# Altium schematic sheet 3.4_4.2V_TO_FIXED_3.3V.SchDoc
size A; SheetNumber: 6; SheetTotal: 30
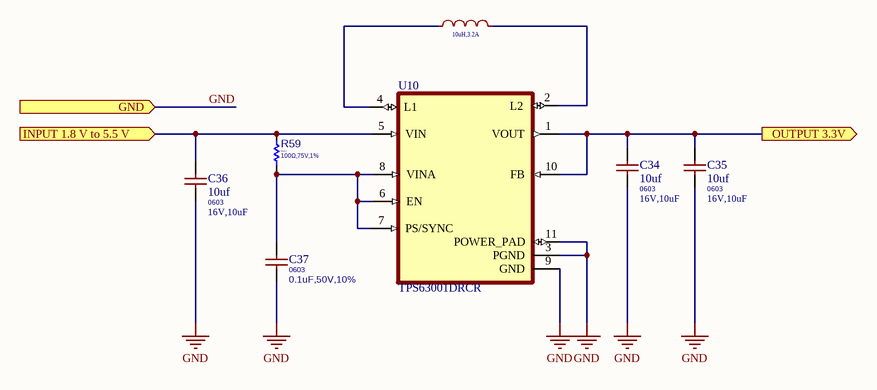
[diagram p0: 3.4_4.2V_TO_FIXED_3.3V.SchDoc]

## Parts
C34  10uf  value 16V,10uF  Package: 0603  [CAPC1608X90N]
C35  10uf  value 16V,10uF  Package: 0603  [CAPC1608X90N]
C36  10uf  value 16V,10uF  Package: 0603  [CAPC1608X90N]
C37  Package: 0603  [C0603]  (hidden comment: 0.1uF,50V,10%)
L1  value 10uH,3.2A  [inductor_SMD,5.2x5.4mm]  (hidden comment: 10uH)
R59  value 100Ω,75V,1%  Package: 0603  [R0603]  (hidden comment: 100Ω)
U10  TPS63001DRCR  [VREG_V62/16624-01YE]

## Ports
GND (in), INPUT 1.8 V to 5.5 V (in), OUTPUT 3.3V (out)

## Nets
GND: C34.1 C35.1 C36.1 C37.1 U10.3(PGND) U10.9(GND) U10.11(POWER_PAD) ; port GND
INPUT 1.8 V to 5.5 V: C36.2 R59.2 U10.5(VIN) ; port INPUT 1.8 V to 5.5 V
OUTPUT 3.3V: C34.2 C35.2 U10.1(VOUT) U10.10(FB) ; port OUTPUT 3.3V
NetC37_2: C37.2 R59.1 U10.6(EN) U10.7(PS/SYNC) U10.8(VINA)
NetL1_1: L1.1 U10.4(L1)
NetL1_2: L1.2 U10.2(L2)

## Library data of the parts
C34-C36 = 0603F106M160NT: 16V 10uF Y5V ±20% 0603 Multilayer Ceramic Capacitors MLCC - SMD/SMT ROHS; Manufacturer: KEMET; MPN: CC0603KRX7R9BB104; Datasheet: http://componentsearchengine.com/Datasheets/3/CC0603KRX7R9BB104.pdf; LCSC: C48906
C37 = GCM188R71H104KA57J: CAP CER 0.1UF 50V X7R 0603; Manufacturer: Murata Electronics; Type: SM; Min Operating Temp: -55°C; Max Operating Temp: 125°C; MPN: GCM188R71H104KA57J; Datasheet: https://datasheet.lcsc.com/lcsc/2404081050_Murata-Electronics-GCM188R71H104KA57J_C3011652.pdf; LCSC: C3011652; Value: 0.1uF,50V,10%
L1 = FXL0530-100-M: 3.2A 10uH Integrated molded inductor ±20% 3.5A SMD,5.2x5.4mm Power Inductors ROHS; Manufacturer: cjiang; LCSC: C177248; MPN: FXL0530-100-M; Package: SMD,5.2x5.4mm; Datasheet: https://atta.szlcsc.com/upload/public/pdf/source/20240426/3189EA8206330E2108542F9E34E540E7.pdf
R59 = AC0603FR-13100RL: 100mW Thick Film Resistors 75V ±100ppm/℃ ±1% 100Ω 0603 Chip Resistor - Surface Mount ROHS; Manufacturer: YAGEO(国巨); Min Operating Temp: -55; Max Operating Temp: +155; Type: *; MPN: AC0603FR-13100RL; Datasheet: https://datasheet.lcsc.com/lcsc/2201180400_YAGEO-AC0603FR-13100RL_C1512172.pdf; LCSC: C1512172
U10 = TPS63001DRCR: 96% Buck-Boost Converter with 1.7A Current Switches, 3.3V fixed Output voltage in 3x3 QFN 10-VSON -40 to 85; MF: Texas Instruments; Texas_Instruments-Purchase-URL: https://snapeda.com/shop?store=Texas+Instruments&id=214718; Value: *; Availability: Good; SnapEDA_Link: https://www.snapeda.com/parts/TPS63001DRCR/Texas%20Instruments/view-part/214718/?ref=snap; Mouser-Purchase-URL: https://snapeda.com/shop?store=Mouser&id=214718; Package: VSON-10 Texas Instruments; DigiKey-Purchase-URL: https://snapeda.com/shop?store=DigiKey&id=214718; MP: TPS63001DRCR; Price: None